# Altium schematic sheet 飞控板.SchDoc
size A2
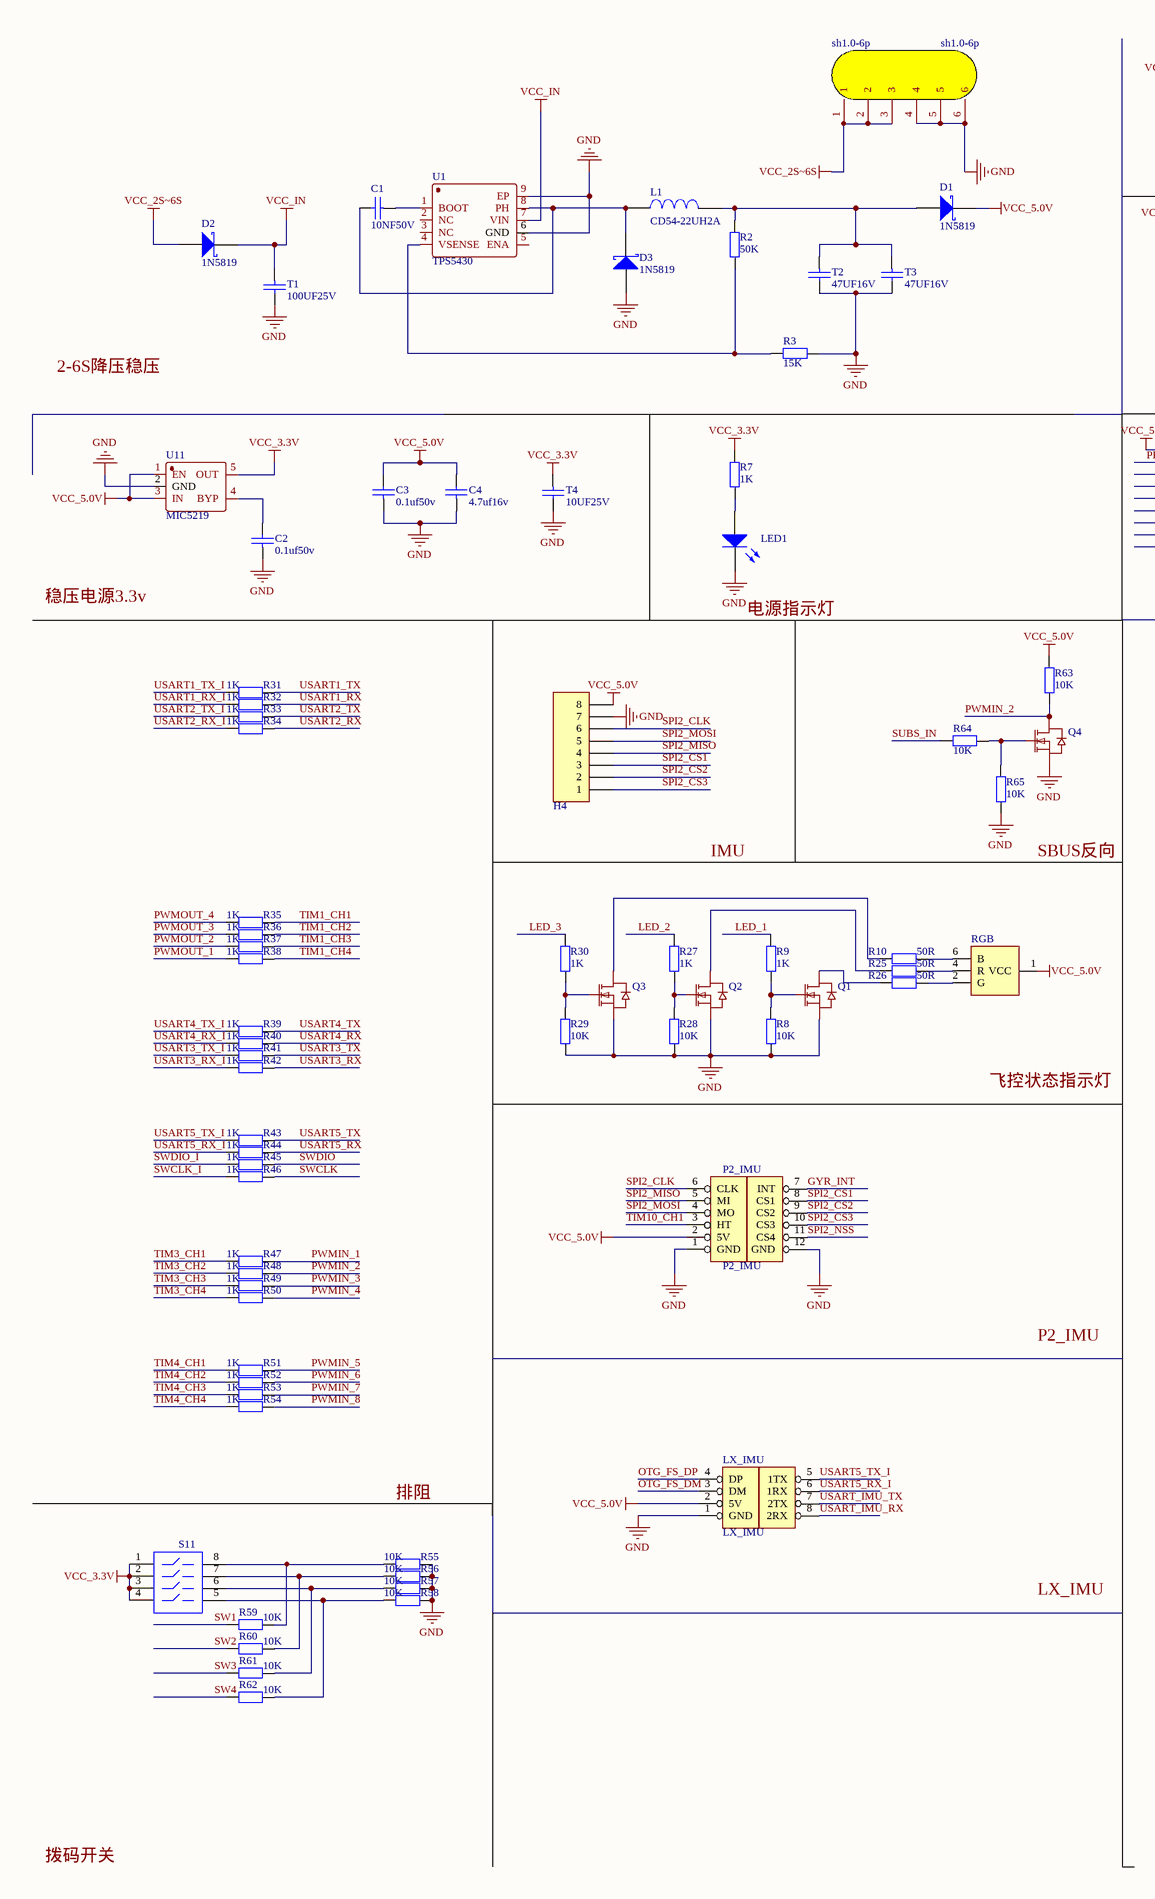
[diagram p0: 飞控板.SchDoc, left]
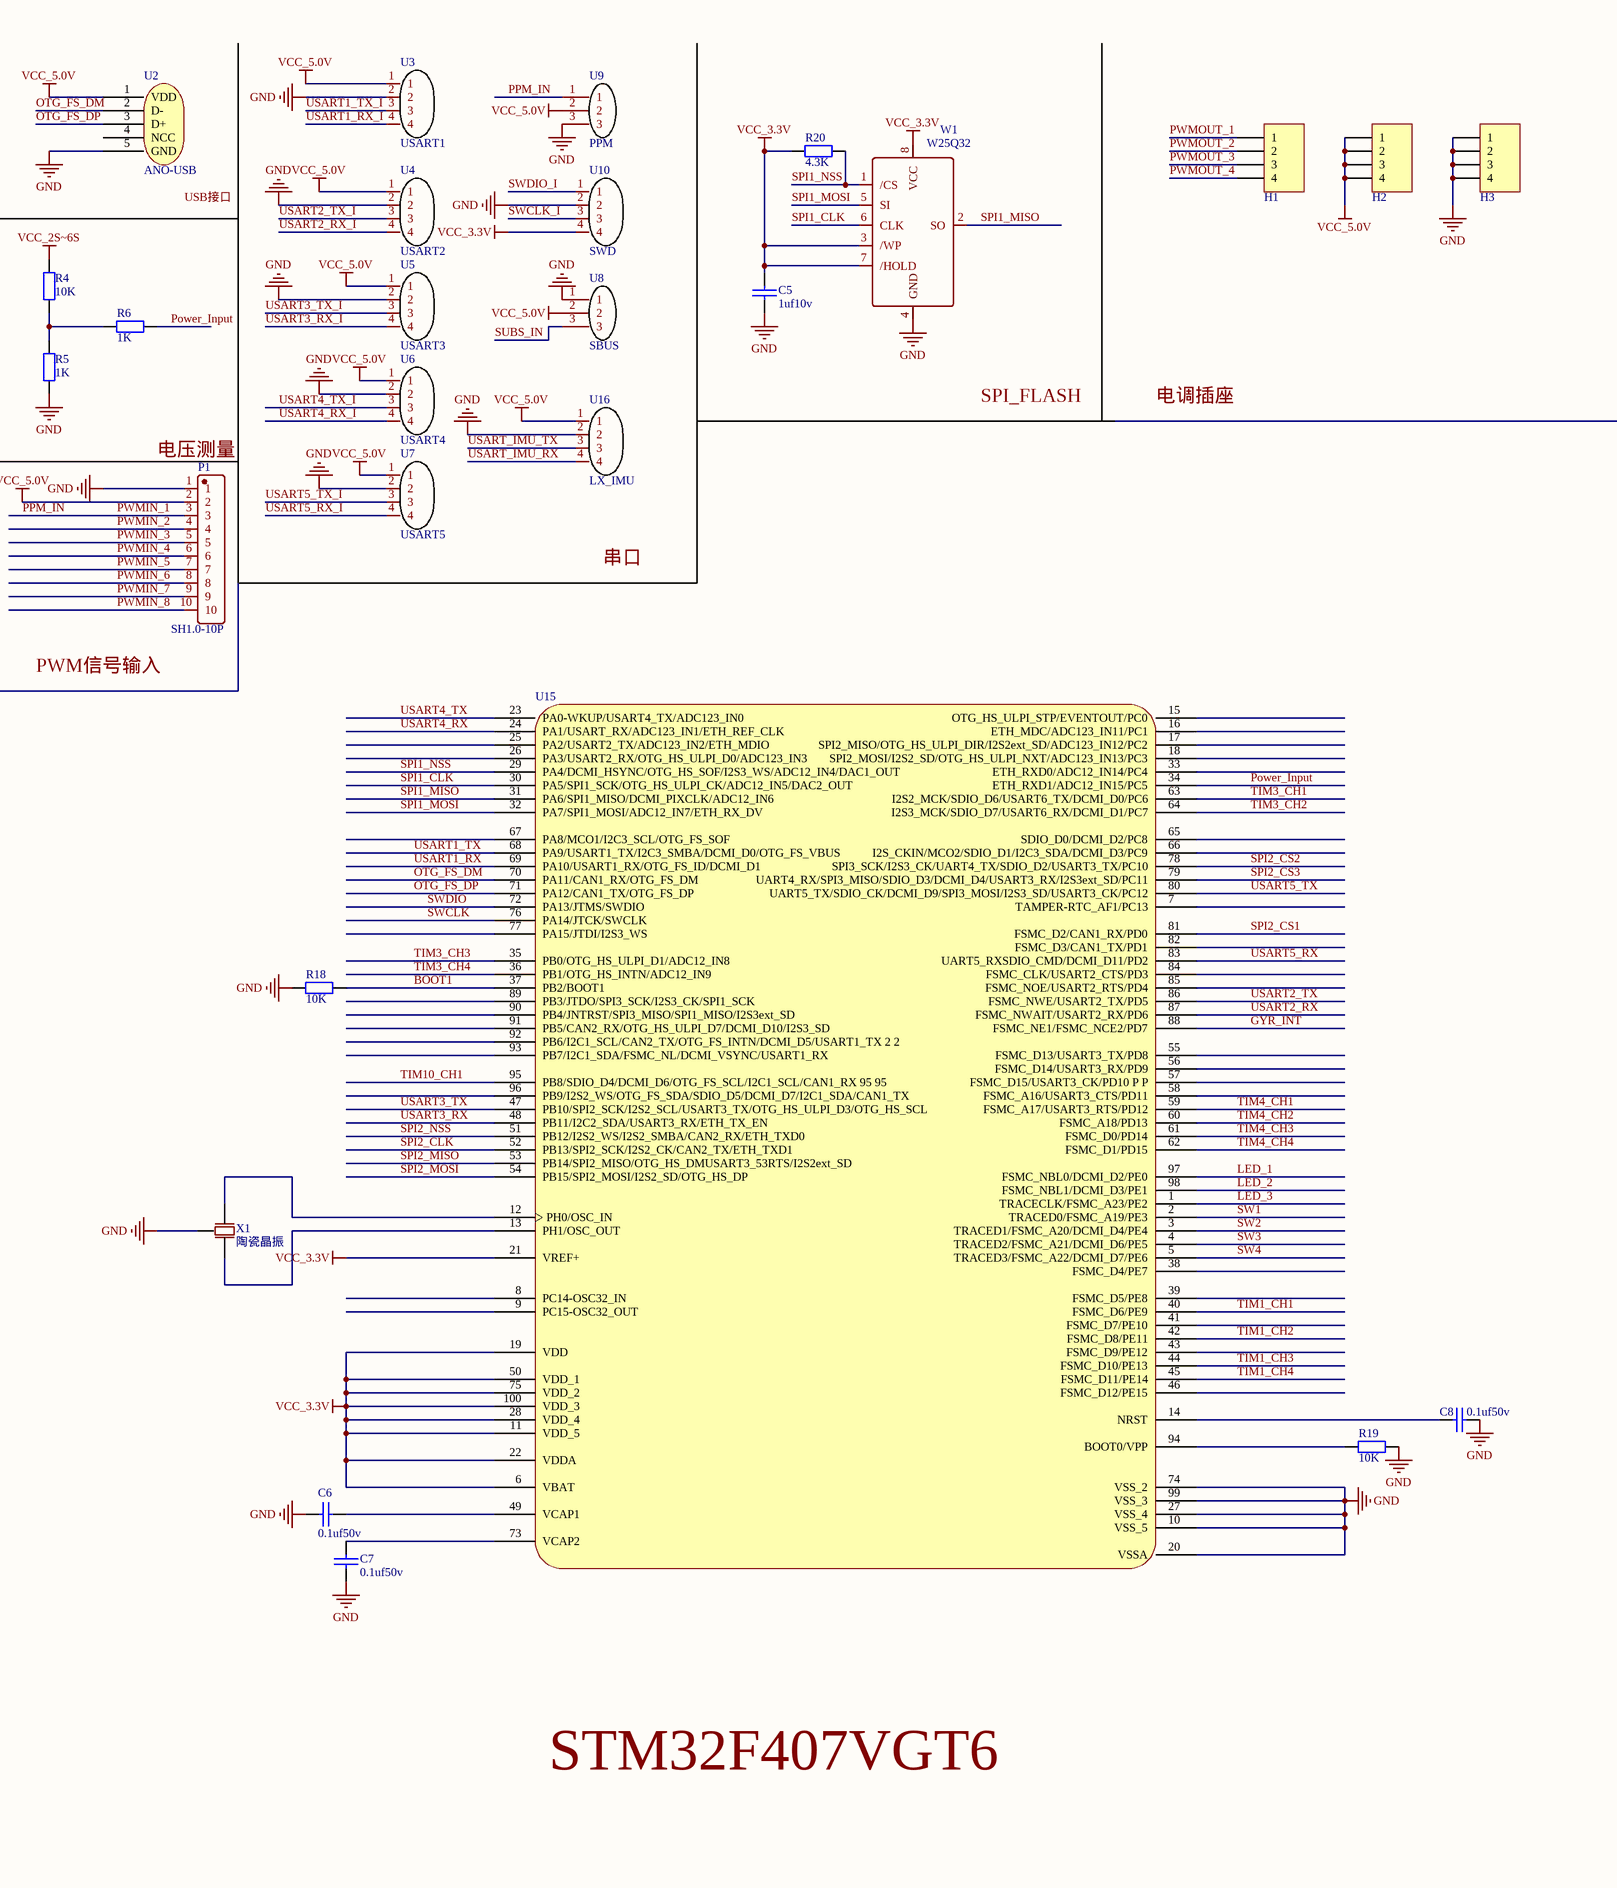
[diagram p1: 飞控板.SchDoc, right]

## Parts
C1  10NF50V  [0805C]
C2  0.1uf50v  [0805C]
C3  0.1uf50v  [0805C]
C4  4.7uf16v  [0805C]
C5  1uf10v  [0805C]
C6  0.1uf50v  [0805C]
C7  0.1uf50v  [0805C]
C8  0.1uf50v  [0805C]
D1  1N5819  [DO214AC_SMA]
D2  1N5819  [DO214AC_SMA]
D3  1N5819  [DO214AC_SMA]
H1  Header 4  [HDR1X4]  (value not drawn)
H2  Header 4  [HDR1X4]  (value not drawn)
H3  Header 4  [HDR1X4]  (value not drawn)
H4  Header 8  [HDR1X8]  (value not drawn)
L1  CD54-22UH2A  [CDRH73]
LED1  (no value)  [LED-1206]
LX_IMU  LX_IMU  [LX_IMU]
P1  SH1.0-10P  [SH1.0-10P]
P2_IMU  P2_IMU  [P2_IMU]
Q1  (no value)  [SI2310]
Q2  (no value)  [SI2310]
Q3  (no value)  [SI2310]
Q4  (no value)  [SI2310]
R2  50K  [0805R]
R3  15K  [0805R]
R4  10K  [0805R]
R5  1K  [0805R]
R6  1K  [0805R]
R7  1K  [0805R]
R8  10K  [0805R]
R9  1K  [0805R]
R10  50R  [0805R]
R18  10K  [0805R]
R19  10K  [0805R]
R20  4.3K  [0805R]
R25  50R  [0805R]
R26  50R  [0805R]
R27  1K  [0805R]
R28  10K  [0805R]
R29  10K  [0805R]
R30  1K  [0805R]
R31  1K  [0805R]
R32  1K  [0805R]
R33  1K  [0805R]
R34  1K  [0805R]
R35  1K  [0805R]
R36  1K  [0805R]
R37  1K  [0805R]
R38  1K  [0805R]
R39  1K  [0805R]
R40  1K  [0805R]
R41  1K  [0805R]
R42  1K  [0805R]
R43  1K  [0805R]
R44  1K  [0805R]
R45  1K  [0805R]
R46  1K  [0805R]
R47  1K  [0805R]
R48  1K  [0805R]
R49  1K  [0805R]
R50  1K  [0805R]
R51  1K  [0805R]
R52  1K  [0805R]
R53  1K  [0805R]
R54  1K  [0805R]
R55  10K  [0805R]
R56  10K  [0805R]
R57  10K  [0805R]
R58  10K  [0805R]
R59  10K  [0805R]
R60  10K  [0805R]
R61  10K  [0805R]
R62  10K  [0805R]
R63  10K  [0805R]
R64  10K  [0805R]
R65  10K  [0805R]
RGB  (no value)  [RGB_LED]
S11  SW-DIP4  [拨码开关4P]  (value not drawn)
sh1.0-6p  sh1.0-6p  [sh1.0-6p]
T1  100UF25V  [0805C]
T2  47UF16V  [0805C]
T3  47UF16V  [0805C]
T4  10UF25V  [0805C]
U1  TPS5430  [TPS5430]
U2  ANO-USB  [ANO-USB]
U3  USART1  [SH1.0-4P]
U4  USART2  [SH1.0-4P]
U5  USART3  [SH1.0-4P]
U6  USART4  [SH1.0-4P]
U7  USART5  [SH1.0-4P]
U8  SBUS  [SH1.0-3P]
U9  PPM  [SH1.0-3P]
U10  SWD  [SH1.0-4P]
U11  MIC5219  [MIC5219]
U15  (no value)  [STM32F407VGT6=]
U16  LX_IMU  [SH1.0-4P]
W1  W25Q32  [W25Q32]
X1  陶瓷晶振  [陶瓷晶振]

## Nets
GND: C2.1 C3.1 C4.1 C5.1 C6.1 C7.1 C8.2 D3.1(A) H3.1 H3.2 H3.3 H3.4 H4.7 LED1.2(K) LX_IMU.1(GND) P1.1 P2_IMU.1(GND) P2_IMU.12(GND) Q1.2(S) Q2.2(S) Q3.2(S) Q4.2(S) R3.2 R5.2 R8.2 R18.2 R19.1 R28.2 R29.2 R55.2 R56.2 R57.2 R58.2 R65.1 sh1.0-6p.4 sh1.0-6p.5 sh1.0-6p.6 T1.2 T2.2 T3.2 T4.2 U1.6(GND) U1.9(EP) U2.5(GND) U3.2 U4.2 U5.2 U6.2 U7.2 U8.1 U9.3 U10.2 U11.2(GND) U15.10(VSS_5) U15.20(VSSA) U15.27(VSS_4) U15.74(VSS_2) U15.99(VSS_3) U16.2 W1.4(GND) X1.2(GND)
VCC_2S~6S: D2.1(A) R4.1 sh1.0-6p.1 sh1.0-6p.2 sh1.0-6p.3
VCC_3.3V: C5.2 R7.1 R20.2 S11.1 S11.2 S11.3 S11.4 T4.1 U10.4 U11.5(OUT) U15.6(VBAT) U15.11(VDD_5) U15.19(VDD) U15.21(VREF+) U15.22(VDDA) U15.28(VDD_4) U15.50(VDD_1) U15.75(VDD_2) U15.100(VDD_3) W1.3(/WP) W1.7(/HOLD) W1.8(VCC)
VCC_5.0V: C3.2 C4.2 D1.2(K) H2.1 H2.2 H2.3 H2.4 H4.8 LX_IMU.2(5V) P1.2 P2_IMU.2(5V) R63.1 RGB.1(VCC) U2.1(VDD) U3.1 U4.1 U5.1 U6.1 U7.1 U8.2 U9.2 U11.1(EN) U11.3(IN) U16.1
VCC_IN: D2.2(K) T1.1 U1.7(VIN)
BOOT1: R18.1 U15.37(PB2/BOOT1)
GYR_INT: P2_IMU.7(INT) U15.88(FSMC_NE1/FSMC_NCE2/PD7)
LED_1: R9.1 U15.97(FSMC_NBL0/DCMI_D2/PE0)
LED_2: R27.1 U15.98(FSMC_NBL1/DCMI_D3/PE1)
LED_3: R30.1 U15.1(TRACECLK/FSMC_A23/PE2)
OTG_FS_DM: LX_IMU.3(DM) U2.2(D-) U15.70(PA11/CAN1_RX/OTG_FS_DM)
OTG_FS_DP: LX_IMU.4(DP) U2.3(D+) U15.71(PA12/CAN1_TX/OTG_FS_DP)
Power_Input: R6.2 U15.34(ETH_RXD1/ADC12_IN15/PC5)
PPM_IN: P1.3 R47.2 U9.1  [also labelled PWMIN_1]
PWMIN_2: P1.4 Q4.3(D) R48.2 R63.2
PWMIN_3: P1.5 R49.2
PWMIN_4: P1.6 R50.2
PWMIN_5: P1.7 R51.2
PWMIN_6: P1.8 R52.2
PWMIN_7: P1.9 R53.2
PWMIN_8: P1.10 R54.2
PWMOUT_1: H1.1 R38.1
PWMOUT_2: H1.2 R37.1
PWMOUT_3: H1.3 R36.1
PWMOUT_4: H1.4 R35.1
SPI1_CLK: U15.30(PA5/SPI1_SCK/OTG_HS_ULPI_CK/ADC12_IN5/DAC2_OUT) W1.6(CLK)
SPI1_MISO: U15.31(PA6/SPI1_MISO/DCMI_PIXCLK/ADC12_IN6) W1.2(SO)
SPI1_MOSI: U15.32(PA7/SPI1_MOSI/ADC12_IN7/ETH_RX_DV) W1.5(SI)
SPI1_NSS: R20.1 U15.29(PA4/DCMI_HSYNC/OTG_HS_SOF/I2S3_WS/ADC12_IN4/DAC1_OUT) W1.1(/CS)
SPI2_CLK: H4.6 P2_IMU.6(CLK) U15.52(PB13/SPI2_SCK/I2S2_CK/CAN2_TX/ETH_TXD1)
SPI2_CS1: H4.3 P2_IMU.8(CS1) U15.81(FSMC_D2/CAN1_RX/PD0)
SPI2_CS2: H4.2 P2_IMU.9(CS2) U15.78(SPI3_SCK/I2S3_CK/UART4_TX/SDIO_D2/USART3_TX/PC10)
SPI2_CS3: H4.1 P2_IMU.10(CS3) U15.79(UART4_RX/SPI3_MISO/SDIO_D3/DCMI_D4/USART3_RX/I2S3ext_SD/PC11)
SPI2_MISO: H4.4 P2_IMU.5(MI) U15.53(PB14/SPI2_MISO/OTG_HS_DMUSART3_53RTS/I2S2ext_SD)
SPI2_MOSI: H4.5 P2_IMU.4(MO) U15.54(PB15/SPI2_MOSI/I2S2_SD/OTG_HS_DP)
SPI2_NSS: P2_IMU.11(CS4) U15.51(PB12/I2S2_WS/I2S2_SMBA/CAN2_RX/ETH_TXD0)
SUBS_IN: R64.1 U8.3
SW1: R59.1 U15.2(TRACED0/FSMC_A19/PE3)
SW2: R60.1 U15.3(TRACED1/FSMC_A20/DCMI_D4/PE4)
SW3: R61.1 U15.4(TRACED2/FSMC_A21/DCMI_D6/PE5)
SW4: R62.1 U15.5(TRACED3/FSMC_A22/DCMI_D7/PE6)
SWCLK: R46.2 U15.76(PA14/JTCK/SWCLK)
SWCLK_I: R46.1 U10.3
SWDIO: R45.2 U15.72(PA13/JTMS/SWDIO)
SWDIO_I: R45.1 U10.1
TIM1_CH1: R35.2 U15.40(FSMC_D6/PE9)
TIM1_CH2: R36.2 U15.42(FSMC_D8/PE11)
TIM1_CH3: R37.2 U15.44(FSMC_D10/PE13)
TIM1_CH4: R38.2 U15.45(FSMC_D11/PE14)
TIM3_CH1: R47.1 U15.63(I2S2_MCK/SDIO_D6/USART6_TX/DCMI_D0/PC6)
TIM3_CH2: R48.1 U15.64(I2S3_MCK/SDIO_D7/USART6_RX/DCMI_D1/PC7)
TIM3_CH3: R49.1 U15.35(PB0/OTG_HS_ULPI_D1/ADC12_IN8)
TIM3_CH4: R50.1 U15.36(PB1/OTG_HS_INTN/ADC12_IN9)
TIM4_CH1: R51.1 U15.59(FSMC_A17/USART3_RTS/PD12)
TIM4_CH2: R52.1 U15.60(FSMC_A18/PD13)
TIM4_CH3: R53.1 U15.61(FSMC_D0/PD14)
TIM4_CH4: R54.1 U15.62(FSMC_D1/PD15)
TIM10_CH1: P2_IMU.3(HT) U15.95(PB8/SDIO_D4/DCMI_D6/OTG_FS_SCL/I2C1_SCL/CAN1_RX_95_95)
USART1_RX: R32.2 U15.69(PA10/USART1_RX/OTG_FS_ID/DCMI_D1)
USART1_RX_I: R32.1 U3.4
USART1_TX: R31.2 U15.68(PA9/USART1_TX/I2C3_SMBA/DCMI_D0/OTG_FS_VBUS)
USART1_TX_I: R31.1 U3.3
USART2_RX: R34.2 U15.87(FSMC_NWAIT/USART2_RX/PD6)
USART2_RX_I: R34.1 U4.4
USART2_TX: R33.2 U15.86(FSMC_NWE/USART2_TX/PD5)
USART2_TX_I: R33.1 U4.3
USART3_RX: R42.2 U15.48(PB11/I2C2_SDA/USART3_RX/ETH_TX_EN)
USART3_RX_I: R42.1 U5.4
USART3_TX: R41.2 U15.47(PB10/SPI2_SCK/I2S2_SCL/USART3_TX/OTG_HS_ULPI_D3/OTG_HS_SCL)
USART3_TX_I: R41.1 U5.3
USART4_RX: R40.2 U15.24(PA1/USART_RX/ADC123_IN1/ETH_REF_CLK)
USART4_RX_I: R40.1 U6.4
USART4_TX: R39.2 U15.23(PA0-WKUP/USART4_TX/ADC123_IN0)
USART4_TX_I: R39.1 U6.3
USART5_RX: R44.2 U15.83(UART5_RXSDIO_CMD/DCMI_D11/PD2)
USART5_RX_I: LX_IMU.6(1RX) R44.1 U7.4
USART5_TX: R43.2 U15.80(UART5_TX/SDIO_CK/DCMI_D9/SPI3_MOSI/I2S3_SD/USART3_CK/PC12)
USART5_TX_I: LX_IMU.5(1TX) R43.1 U7.3
USART_IMU_RX: LX_IMU.8(2RX) U16.4
USART_IMU_TX: LX_IMU.7(2TX) U16.3
NetC1_1: C1.1 U1.1(BOOT)
NetC1_2: C1.2 D3.2(K) L1.1 U1.8(PH)
NetC2_2: C2.2 U11.4(BYP)
NetC6_2: C6.2 U15.49(VCAP1)
NetC7_2: C7.2 U15.73(VCAP2)
NetC8_1: C8.1 U15.14(NRST)
NetD1_1: D1.1(A) L1.2 R2.1 T2.1 T3.1
NetLED1_1: LED1.1(A) R7.2
NetQ1_1: Q1.1(G) R8.1 R9.2
NetQ1_3: Q1.3(D) R26.2
NetQ2_1: Q2.1(G) R27.2 R28.1
NetQ2_3: Q2.3(D) R25.2
NetQ3_1: Q3.1(G) R29.1 R30.2
NetQ3_3: Q3.3(D) R10.2
NetQ4_1: Q4.1(G) R64.2 R65.2
NetR2_2: R2.2 R3.1 U1.4(VSENSE)
NetR4_2: R4.2 R5.1 R6.1
NetR10_1: R10.1 RGB.6(B)
NetR19_2: R19.2 U15.94(BOOT0/VPP)
NetR25_1: R25.1 RGB.4(R)
NetR26_1: R26.1 RGB.2(G)
NetR55_1: R55.1 R59.2 S11.8
NetR56_1: R56.1 R60.2 S11.7
NetR57_1: R57.1 R61.2 S11.6
NetR58_1: R58.1 R62.2 S11.5
NetU15_12: U15.12(PH0/OSC_IN) X1.3(OSC2)
NetU15_13: U15.13(PH1/OSC_OUT) X1.1(OSC1)

Not connected (* = marked no-connect by the designer): U1 2(NC) 3(NC) 5(ENA); U2 4(NCC); U15 7(TAMPER-RTC_AF1/PC13) 8(PC14-OSC32_IN) 9(PC15-OSC32_OUT) 15(OTG_HS_ULPI_STP/EVENTOUT/PC0) 16(ETH_MDC/ADC123_IN11/PC1) 17(SPI2_MISO/OTG_HS_ULPI_DIR/I2S2ext_SD/ADC123_IN12/PC2) 18(SPI2_MOSI/I2S2_SD/OTG_HS_ULPI_NXT/ADC123_IN13/PC3) 25(PA2/USART2_TX/ADC123_IN2/ETH_MDIO) 26(PA3/USART2_RX/OTG_HS_ULPI_D0/ADC123_IN3) 33(ETH_RXD0/ADC12_IN14/PC4) 38(FSMC_D4/PE7) 39(FSMC_D5/PE8) 41(FSMC_D7/PE10) 43(FSMC_D9/PE12) 46(FSMC_D12/PE15) 55(FSMC_D13/USART3_TX/PD8) 56(FSMC_D14/USART3_RX/PD9) 57(FSMC_D15/USART3_CK/PD10_P_P) 58(FSMC_A16/USART3_CTS/PD11) 65(SDIO_D0/DCMI_D2/PC8) 66(I2S_CKIN/MCO2/SDIO_D1/I2C3_SDA/DCMI_D3/PC9) 67(PA8/MCO1/I2C3_SCL/OTG_FS_SOF) 77(PA15/JTDI/I2S3_WS) 82(FSMC_D3/CAN1_TX/PD1) 84(FSMC_CLK/USART2_CTS/PD3) 85(FSMC_NOE/USART2_RTS/PD4) 89(PB3/JTDO/SPI3_SCK/I2S3_CK/SPI1_SCK) 90(PB4/JNTRST/SPI3_MISO/SPI1_MISO/I2S3ext_SD) 91(PB5/CAN2_RX/OTG_HS_ULPI_D7/DCMI_D10/I2S3_SD) 92(PB6/I2C1_SCL/CAN2_TX/OTG_FS_INTN/DCMI_D5/USART1_TX_2_2) 93(PB7/I2C1_SDA/FSMC_NL/DCMI_VSYNC/USART1_RX) 96(PB9/I2S2_WS/OTG_FS_SDA/SDIO_D5/DCMI_D7/I2C1_SDA/CAN1_TX)

## Notes on the sheet
- Labels drawn without touching a wire or pin: 2-6S降压稳压, IMU, LX_IMU, P2_IMU, PWM信号输入, SBUS反向, SPI_FLASH, STM32F407VGT6, USB接口, 串口, 拨码开关, 排阻, 电压测量, 电源指示灯, 电调插座, 稳压电源3.3v, 飞控状态指示灯

## Library data of the parts
C1-C8 T1-T4 = CAP: 无极性电容
D1-D3 = 1N5817-5819SMD: 贴片肖特基二极管
H1-H3 = Header 4: Header, 4-Pin; LatestRevisionDate: 17-Jul-2002; LatestRevisionNote: Re-released for DXP Platform.; Publisher: Altium Limited
H4 = Header 8: Header, 8-Pin; LatestRevisionDate: 17-Jul-2002; LatestRevisionNote: Re-released for DXP Platform.; Publisher: Altium Limited
L1 = INDUCTOR
LED1 = LED1206
P2_IMU = Component_1
Q1-Q4 = SI2310
R2-R10 R18-R20 R25-R65 = Res_0805: 0805贴片电阻
RGB = RGB
S11 = SW-DIP4: 4P拨码开关; Published: 24-Mar-1999; LatestRevisionDate: 17-Jul-2002; LatestRevisionNote: Re-released for DXP Platform.; PackageReference: DIP-8; Publisher: Altium Limited
U3-U7 U10 U16 = SH1.0-4P
U8 U9 = SH1.0-3P
U15 = STM32F407VGT6=